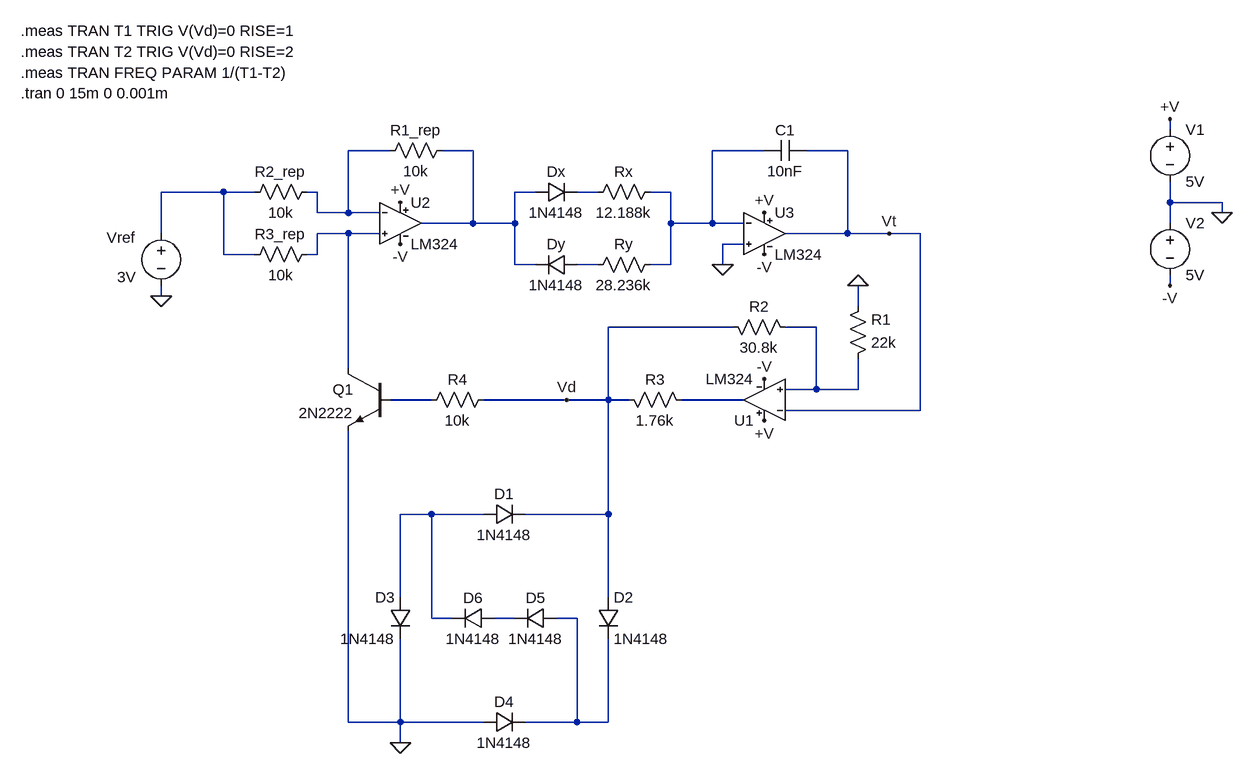
[diagram p0: schematic Proiect-Matematic.asc]
Proiect-Matematic.asc, the LTspice schematic file:
Version 4
SHEET 1 980 1044
WIRE 432 -480 432 -496
WIRE -768 -448 -832 -448
WIRE -640 -448 -688 -448
WIRE -192 -448 -272 -448
WIRE -64 -448 -128 -448
WIRE -1024 -384 -1120 -384
WIRE -976 -384 -1024 -384
WIRE -880 -384 -896 -384
WIRE -544 -384 -576 -384
WIRE -448 -384 -480 -384
WIRE -336 -384 -368 -384
WIRE 432 -368 432 -400
WIRE 512 -368 432 -368
WIRE -880 -352 -880 -384
WIRE -832 -352 -832 -448
WIRE -832 -352 -880 -352
WIRE -784 -352 -832 -352
WIRE 512 -352 512 -368
WIRE -640 -336 -640 -448
WIRE -640 -336 -720 -336
WIRE -576 -336 -576 -384
WIRE -576 -336 -640 -336
WIRE -336 -336 -336 -384
WIRE -272 -336 -272 -448
WIRE -272 -336 -336 -336
WIRE -224 -336 -272 -336
WIRE 432 -336 432 -368
WIRE -1120 -320 -1120 -384
WIRE -832 -320 -880 -320
WIRE -784 -320 -832 -320
WIRE -64 -320 -64 -448
WIRE -64 -320 -160 -320
WIRE 0 -320 -64 -320
WIRE 48 -320 0 -320
WIRE -224 -304 -256 -304
WIRE -1024 -288 -1024 -384
WIRE -976 -288 -1024 -288
WIRE -880 -288 -880 -320
WIRE -880 -288 -896 -288
WIRE -576 -272 -576 -336
WIRE -544 -272 -576 -272
WIRE -448 -272 -480 -272
WIRE -336 -272 -336 -336
WIRE -336 -272 -368 -272
WIRE -256 -272 -256 -304
WIRE 432 -240 432 -256
WIRE -1120 -224 -1120 -240
WIRE -48 -208 -48 -240
WIRE -240 -176 -432 -176
WIRE -112 -176 -160 -176
WIRE -832 -112 -832 -320
WIRE -112 -80 -112 -176
WIRE -112 -80 -160 -80
WIRE -48 -80 -48 -128
WIRE -48 -80 -112 -80
WIRE -704 -64 -768 -64
WIRE -496 -64 -624 -64
WIRE -432 -64 -432 -176
WIRE -432 -64 -496 -64
WIRE -400 -64 -432 -64
WIRE -224 -64 -320 -64
WIRE 48 -48 48 -320
WIRE 48 -48 -160 -48
WIRE -704 112 -752 112
WIRE -624 112 -704 112
WIRE -432 112 -432 -64
WIRE -432 112 -560 112
WIRE -752 240 -752 112
WIRE -432 240 -432 112
WIRE -704 272 -704 112
WIRE -672 272 -704 272
WIRE -576 272 -608 272
WIRE -480 272 -512 272
WIRE -832 432 -832 -16
WIRE -752 432 -752 304
WIRE -752 432 -832 432
WIRE -624 432 -752 432
WIRE -480 432 -480 272
WIRE -480 432 -560 432
WIRE -432 432 -432 304
WIRE -432 432 -480 432
WIRE -752 464 -752 432
FLAG 512 -352 0
FLAG 432 -496 +V
FLAG 432 -240 -V
FLAG -192 -32 +V
FLAG -192 -96 -V
FLAG -752 464 0
FLAG -1120 -224 0
FLAG -752 -304 -V
FLAG -752 -368 +V
FLAG -192 -352 +V
FLAG -192 -288 -V
FLAG -256 -272 0
FLAG -48 -240 0
FLAG -496 -64 Vd
FLAG 0 -320 Vt
SYMBOL voltage 432 -496 R0
SYMATTR InstName V1
SYMATTR Value 5V
SYMBOL voltage 432 -352 R0
SYMATTR InstName V2
SYMATTR Value 5V
SYMBOL LM324 -192 0 R180
SYMATTR InstName U1
SYMBOL res -64 -112 M180
WINDOW 0 36 76 Left 2
WINDOW 3 36 40 Left 2
SYMATTR InstName R1
SYMATTR Value 22k
SYMBOL res -256 -192 M90
WINDOW 0 0 56 VBottom 2
WINDOW 3 32 56 VTop 2
SYMATTR InstName R2
SYMATTR Value 30.8k
SYMBOL res -416 -80 M90
WINDOW 0 0 56 VBottom 2
WINDOW 3 32 56 VTop 2
SYMATTR InstName R3
SYMATTR Value 1.76k
SYMBOL diode -448 240 R0
SYMATTR InstName D2
SYMATTR Value 1N4148
SYMBOL diode -624 128 R270
WINDOW 0 32 32 VTop 2
WINDOW 3 0 32 VBottom 2
SYMATTR InstName D1
SYMATTR Value 1N4148
SYMBOL diode -736 240 M0
SYMATTR InstName D3
SYMATTR Value 1N4148
SYMBOL diode -624 448 R270
WINDOW 0 32 32 VTop 2
WINDOW 3 0 32 VBottom 2
SYMATTR InstName D4
SYMATTR Value 1N4148
SYMBOL diode -512 256 R90
WINDOW 0 0 32 VBottom 2
WINDOW 3 32 32 VTop 2
SYMATTR InstName D5
SYMATTR Value 1N4148
SYMBOL diode -608 256 R90
WINDOW 0 0 32 VBottom 2
WINDOW 3 32 32 VTop 2
SYMATTR InstName D6
SYMATTR Value 1N4148
SYMBOL res -608 -80 R90
WINDOW 0 0 56 VBottom 2
WINDOW 3 32 56 VTop 2
SYMATTR InstName R4
SYMATTR Value 10k
SYMBOL npn -768 -112 M0
SYMATTR InstName Q1
SYMATTR Value 2N2222
SYMBOL LM324 -752 -400 R0
SYMATTR InstName U2
SYMBOL res -672 -464 R90
WINDOW 0 0 56 VBottom 2
WINDOW 3 32 56 VTop 2
SYMATTR InstName R1_rep
SYMATTR Value 10k
SYMBOL res -880 -304 R90
WINDOW 0 0 56 VBottom 2
WINDOW 3 32 56 VTop 2
SYMATTR InstName R3_rep
SYMATTR Value 10k
SYMBOL res -880 -400 R90
WINDOW 0 0 56 VBottom 2
WINDOW 3 32 56 VTop 2
SYMATTR InstName R2_rep
SYMATTR Value 10k
SYMBOL voltage -1120 -336 R0
WINDOW 0 -84 22 Left 2
WINDOW 3 -68 83 Left 2
WINDOW 123 0 0 Left 0
WINDOW 39 0 0 Left 0
SYMATTR InstName Vref
SYMATTR Value 3V
SYMBOL LM324 -192 -384 R0
SYMATTR InstName U3
SYMBOL diode -544 -368 R270
WINDOW 0 32 32 VTop 2
WINDOW 3 0 32 VBottom 2
SYMATTR InstName Dx
SYMATTR Value 1N4148
SYMBOL diode -480 -256 M270
WINDOW 0 32 32 VTop 2
WINDOW 3 0 32 VBottom 2
SYMATTR InstName Dy
SYMATTR Value 1N4148
SYMBOL res -352 -400 R90
WINDOW 0 0 56 VBottom 2
WINDOW 3 32 56 VTop 2
SYMATTR InstName Rx
SYMATTR Value 12.188k
SYMBOL res -352 -288 R90
WINDOW 0 0 56 VBottom 2
WINDOW 3 32 56 VTop 2
SYMATTR InstName Ry
SYMATTR Value 28.236k
SYMBOL cap -128 -464 R90
WINDOW 0 0 32 VBottom 2
WINDOW 3 32 32 VTop 2
SYMATTR InstName C1
SYMATTR Value 10nF
TEXT -1336 -536 Left 2 !.tran 0 15m 0 0.001m
TEXT -1336 -632 Left 2 !.meas TRAN T1 TRIG V(Vd)=0 RISE=1
TEXT -1336 -600 Left 2 !.meas TRAN T2 TRIG V(Vd)=0 RISE=2
TEXT -1336 -568 Left 2 !.meas TRAN FREQ PARAM 1/(T1-T2)

The netlist it stands for:
* Proiect-Matematic.asc
V1 +V 0 5V
V2 0 -V 5V
XU1 N008 Vt +V -V N010 LM324  ; pins In+ In- V+ V- OUT
R1 N008 0 22k
R2 Vd N008 30.8k
R3 Vd N010 1.76k
D2 Vd N013 1N4148
D1 N011 Vd 1N4148
D3 N011 0 1N4148
D4 0 N013 1N4148
D5 N013 N012 1N4148
D6 N012 N011 1N4148
R4 Vd N009 10k
Q1 N006 N009 0 0 2N2222
XU2 N006 N001 +V -V N002 LM324  ; pins In+ In- V+ V- OUT
R1_rep N002 N001 10k
R3_rep N006 N004 10k
R2_rep N001 N004 10k
Vref N004 0 3V
XU3 0 N003 +V -V Vt LM324  ; pins In+ In- V+ V- OUT
Dx N002 N005 1N4148
Dy N007 N002 1N4148
Rx N003 N005 12.188k
Ry N003 N007 28.236k
C1 Vt N003 10nF
.model D D
.lib standard.dio
.model NPN NPN
.model PNP PNP
.lib standard.bjt
.tran 0 15m 0 0.001m
.meas TRAN T1 TRIG V(Vd)=0 RISE=1
.meas TRAN T2 TRIG V(Vd)=0 RISE=2
.meas TRAN FREQ PARAM 1/(T1-T2)
.lib LM324.lib
.backanno
.end